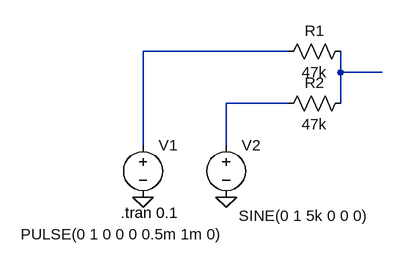
[diagram p0: schematic RC-circuit.asc]
RC-circuit.asc, the LTspice schematic file:
Version 4
SHEET 1 880 680
WIRE 288 80 64 80
WIRE 368 112 368 80
WIRE 432 112 368 112
WIRE 288 160 192 160
WIRE 368 160 368 112
WIRE 64 224 64 80
WIRE 192 224 192 160
FLAG 64 304 0
FLAG 192 304 0
SYMBOL voltage 64 208 R0
WINDOW 3 -188 153 Left 2
WINDOW 123 0 0 Left 2
WINDOW 39 0 0 Left 2
SYMATTR InstName V1
SYMATTR Value PULSE(0 1 0 0 0 0.5m 1m 0)
SYMBOL voltage 192 208 R0
WINDOW 3 19 125 Left 2
WINDOW 123 0 0 Left 2
WINDOW 39 0 0 Left 2
SYMATTR InstName V2
SYMATTR Value SINE(0 1 5k 0 0 0)
SYMBOL res 384 64 R90
WINDOW 0 0 56 VBottom 2
WINDOW 3 32 56 VTop 2
SYMATTR InstName R1
SYMATTR Value 47k
SYMBOL res 384 144 R90
WINDOW 0 0 56 VBottom 2
WINDOW 3 32 56 VTop 2
SYMATTR InstName R2
SYMATTR Value 47k
TEXT 30 328 Left 2 !.tran 0.1

The netlist it stands for:
* RC-circuit.asc
V1 N001 0 PULSE(0 1 0 0 0 0.5m 1m 0)
V2 N003 0 SINE(0 1 5k 0 0 0)
R1 N002 N001 47k
R2 N002 N003 47k
.tran 0.1
.backanno
.end